# Altium schematic sheet SW108_0713.SchDoc
size A4
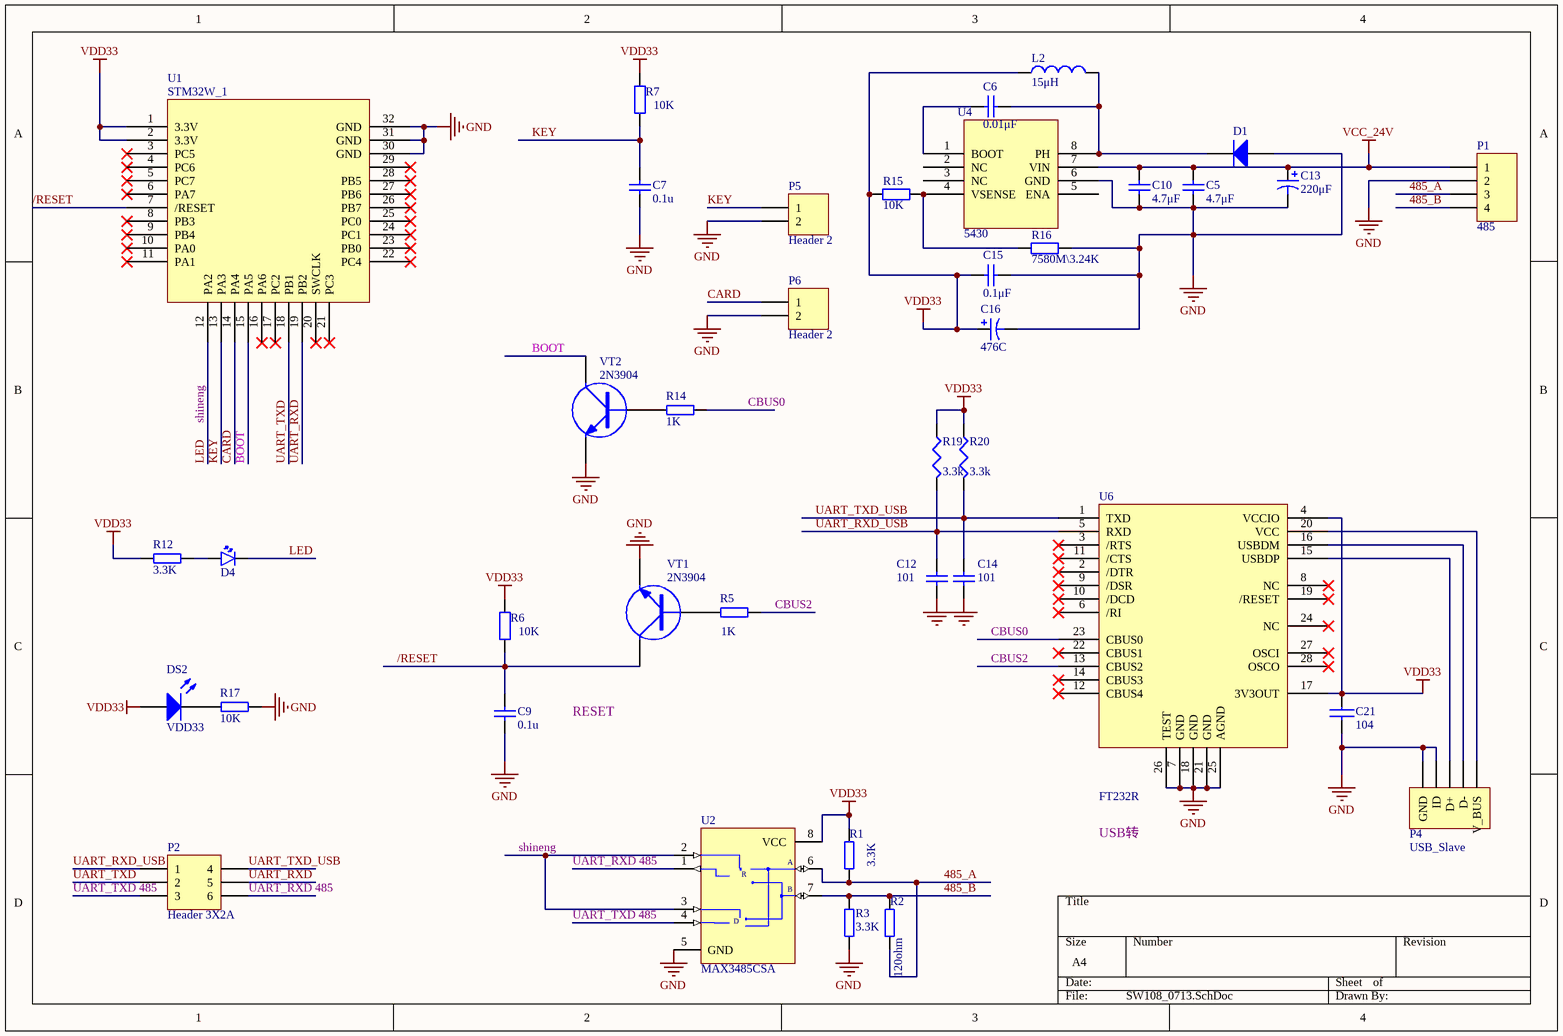
[diagram p0: SW108_0713.SchDoc]

## Parts
C5  4.7μF  [C0603]
C6  0.01μF  [C0603]
C7  0.1u  [C0603]
C9  0.1u  [C0603]
C10  4.7μF  [C0603]
C12  101  [C0603]
C13  220μF  [CZ3.0/6.5]
C14  101  [C0603]
C15  0.1μF  [C0603]
C16  476C  [7343]
C21  104  [C0603]
D1  Diode 1N5408  [UF3B]  (value not drawn)
D4  green LED  [LED]  (value not drawn)
DS2  VDD33  [LED]
L2  15μH  [L2]
P1  485  [4kongzhen]
P2  Header 3X2A  [HDR2X3_CEN]
P4  USB_Slave  [USBfoot]
P5  Header 2  [HDR1X2]
P6  Header 2  [HDR1X2]
R1  3.3K  [R0603]
R2  120ohm  [R0603]
R3  3.3K  [R0603]
R5  1K  [R0603]
R6  value 10K  [R0603]  (hidden comment: Res2)
R7  value 10K  [R0603]  (hidden comment: Res2)
R12  3.3K  [R0603]
R14  1K  [R0603]
R15  10K  [R0603]
R16  7580M\3.24K  [R0603]
R17  10K  [R0603]
R19  3.3k  [R0603]
R20  3.3k  [R0603]
U1  STM32W_1  [STM32W108-3]
U2  MAX3485CSA  [SO-8]
U4  5430  [SO-8]
U6  FT232R  [SSOP-28]
VT1  2N3904  [SOT23-3]
VT2  2N3904  [SOT23-3]

## Nets
GND: C5.1 C7.1 C9.1 C10.1 C12.1 C13.2 C14.1 C15.2 C16.2 C21.2 D1.1(A) P1.2 P4.4(ID) P4.5(GND) P5.2 P6.2 R3.1 R16.2 R17.1 U1.30(GND) U1.31(GND) U1.32(GND) U2.5(GND) U4.6(GND) U6.7(GND) U6.18(GND) U6.21(GND) U6.25(AGND) U6.26(TEST) VT1.2(E) VT2.2(E)
VCC_24V: C5.2 C10.2 C13.1 P1.1 U4.7(VIN)
VDD33: C15.1 C16.1 C21.1 DS2.1(A) L2.1 R1.2 R6.2 R7.2 R12.1 R15.1 R19.1 R20.1 U1.1(3.3V) U1.2(3.3V) U2.8(VCC) U6.4(VCCIO) U6.17(3V3OUT)
485_A: P1.3 R1.1 R2.2 U2.6(A)
485_B: P1.4 R2.1 R3.2 U2.7(B)
/RESET: C9.2 R6.1 U1.7(/RESET) VT1.3(C)
BOOT: U1.15(PA5) VT2.3(C)
CARD: P6.1 U1.14(PA4)
CBUS0: R14.2 U6.23(CBUS0)
CBUS2: R5.2 U6.13(CBUS2)
KEY: C7.2 P5.1 R7.1 U1.13(PA3)
LED: D4.2(K) U1.12(PA2) U2.2(~{RE}) U2.3(DE)  [also labelled shineng]
UART_RXD: P2.5 U1.19(PB2)
UART_RXD 485: P2.6 U2.1(RO)
UART_RXD_USB: C12.2 P2.1 R19.2 U6.5(RXD)
UART_TXD: P2.2 U1.18(PB1)
UART_TXD 485: P2.3 U2.4(DI)
UART_TXD_USB: C14.2 P2.4 R20.2 U6.1(TXD)
NetC6_1: C6.1 U4.1(BOOT)
NetC6_2: C6.2 D1.2(K) L2.2 U4.8(PH)
NetD4_1: D4.1(A) R12.2
NetDS2_2: DS2.2(K) R17.2
NetP4_1: P4.1(V_BUS) U6.20(VCC)
NetP4_2: P4.2(D-) U6.16(USBDM)
NetP4_3: P4.3(D+) U6.15(USBDP)
NetR5_1: R5.1 VT1.1(B)
NetR14_1: R14.1 VT2.1(B)
NetR15_2: R15.2 R16.1 U4.4(VSENSE)

Not connected (* = marked no-connect by the designer): U1 3(PC5)* 4(PC6)* 5(PC7)* 6(PA7)* 8(PB3)* 9(PB4)* 10(PA0)* 11(PA1)* 16(PA6)* 17(PC2)* 20(SWCLK)* 21(PC3)* 22(PC4)* 23(PB0)* 24(PC1)* 25(PC0)* 26(PB7)* 27(PB6)* 28(PB5)* 29*; U4 2(NC) 3(NC) 5(ENA); U6 2(/DTR)* 3(/RTS)* 6(/RI)* 8(NC)* 9(/DSR)* 10(/DCD)* 11(/CTS)* 12(CBUS4)* 14(CBUS3)* 19(/RESET)* 22(CBUS1)* 24(NC)* 27(OSCI)* 28(OSCO)*

## Notes on the sheet
- RESET
- USB转
- (in symbol MAX485CSA) R; D

## Library data of the parts
C5 C6 C10 C15 = Cap: Capacitor; Value: 0.01uF; Published: 8-Jun-2000; LatestRevisionDate: 17-Jul-2002; LatestRevisionNote: Re-released for DXP Platform.; PackageReference: RAD-0.3; Publisher: Altium Limited; PackageDescription: Radial Cap, Thru-Hole; 2 Leads; 0.3 in Pin Spacing
C7 C9 C12 C14 = Cap: Capacitor; Value: 100pF; Published: 8-Jun-2000; LatestRevisionDate: 17-Jul-2002; LatestRevisionNote: Re-released for DXP Platform.; Publisher: Altium Limited
C13 = Cap Pol1: Polarized Capacitor (Radial); Value: 1uF; Published: 8-Jun-2000; LatestRevisionDate: 17-Jul-2002; LatestRevisionNote: Re-released for DXP Platform.; PackageReference: RB7.6-15; Publisher: Altium Limited; PackageDescription: Polarized Capacitor (Radial); 2 Leads
C16 = Cap Pol1: Polarized Capacitor (Radial); Value: 2.2uF; Published: 8-Jun-2000; LatestRevisionDate: 17-Jul-2002; LatestRevisionNote: Re-released for DXP Platform.; PackageReference: RB7.6-15; Publisher: Altium Limited; PackageDescription: Polarized Capacitor (Radial); 2 Leads
C21 = C: Right: 20; Bottom: 10
D1 = Diode 1N5408: 3 Amp Medium Power Silicon Rectifier Diode; Published: 8-Jun-2000; LatestRevisionDate: 17-Jul-2002; LatestRevisionNote: Re-released for DXP Platform.; DatasheetVersion: Aug-1984; PackageReference: DO-201AD; Publisher: Altium Limited; PackageDescription: Diode, Axial; Body 9.5 x 5.3 mm (LxDia. max), Lead Dia. 1.32 mm (max); ComponentLink1Description: Manufacturer Link; ComponentLink1URL: http://www.irf.com/
D4 = LED
DS2 = LED3: Typical BLUE SiC LED; Published: 8-Jun-2000; LatestRevisionDate: 17-Dec-2003; LatestRevisionNote: PCB Footprint replaced.; Publisher: Altium Limited
L2 = Inductor: Code_IEC: 1005; Value: 10mH; Published: 8-Jun-2000; LatestRevisionDate: 29-May-2009; LatestRevisionNote: IPC-7351 Footprint Added.; PackageReference: 0402-A; Publisher: Altium Limited; PackageDescription: Chip Inductor; Code_JEITA: 0402
P1 = Header 4: Header, 4-Pin; LatestRevisionDate: 17-Jul-2002; LatestRevisionNote: Re-released for DXP Platform.; Publisher: Altium Limited
P2 = Header 3X2A: Header, 3-Pin, Dual row; LatestRevisionDate: 17-Jul-2002; LatestRevisionNote: Re-released for DXP Platform.; Publisher: Altium Limited
P4 = Header 5: Header, 5-Pin; LatestRevisionDate: 17-Jul-2002; LatestRevisionNote: Re-released for DXP Platform.; Publisher: Altium Limited
P5 P6 = Header 2: Header, 2-Pin; LatestRevisionDate: 17-Jul-2002; LatestRevisionNote: Re-released for DXP Platform.; Publisher: Altium Limited
R1-R3 R5 R12 R14 R17 = RES: R
R6 R7 = Res2: Resistor; Published: 8-Jun-2000; LatestRevisionDate: 17-Jul-2002; LatestRevisionNote: Re-released for DXP Platform.; PackageReference: AXIAL-0.4; Publisher: Altium Limited
R15 = Res2: Resistor; Value: 100K; Published: 8-Jun-2000; LatestRevisionDate: 17-Jul-2002; LatestRevisionNote: Re-released for DXP Platform.; PackageReference: AXIAL-0.4; Publisher: Altium Limited; PackageDescription: Axial Device, Thru-Hole; 2 Leads; 0.4 in Pin Spacing
R16 = Res2: Resistor; Value: 1K; Published: 8-Jun-2000; LatestRevisionDate: 17-Jul-2002; LatestRevisionNote: Re-released for DXP Platform.; PackageReference: AXIAL-0.4; Publisher: Altium Limited; PackageDescription: Axial Device, Thru-Hole; 2 Leads; 0.4 in Pin Spacing
R19 R20 = Res3: Resistor; Value: 1K; Published: 8-Jun-2000; LatestRevisionDate: 17-Jul-2002; LatestRevisionNote: Re-released for DXP Platform.; Publisher: Altium Limited
U1 = STM32W108-3
U2 = MAX485CSA: Low-Power, Slew-Rate-Limited RS-485/RS-422 Transceiver; Published: 16-Jan-2001; LatestRevisionDate: 13-Apr-2006; LatestRevisionNote: IPC-7351 Footprint Added.; DatasheetVersion: Feb-1996; PackageReference: NSO8; Publisher: Altium Limited; PackageDescription: 8-Pin Small Outline Integrated Circuit 1.27 mm Pitch; Code_JEDEC: MS-012-AA; Code_IPC: SOIC127P600-8; ComponentLink1Description: Manufacturer Link; ComponentLink1URL: http://www.maxim-ic.com/; ComponentLink2Description: Datasheet; ComponentLink2URL: http://pdfserv.maxim-ic.com/en/ds/MAX1487-MAX491.pdf
VT1 VT2 = NPN: NPN Transistor